# Altium project PCB_Project.PrjPcb
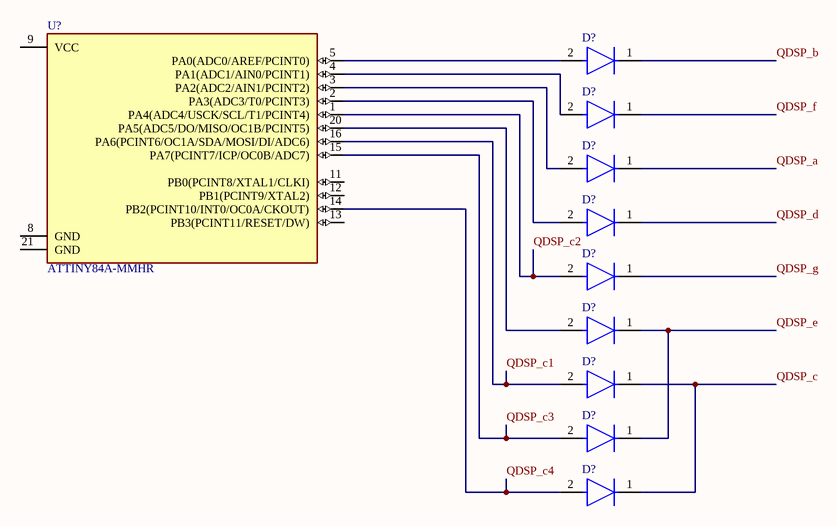
[diagram p0: main.SchDoc]
1 sheet, 10 parts. Net scope: global (net labels, ports and power ports of the same name join across sheets).

## Sheet main.SchDoc
size A4; SheetNumber: 1; SheetTotal: 1

### Parts
(Parts that share a designator on the sheet are numbered #1, #2 ... from top to bottom, then left to right.)
D?#1  1N4148  [FP-017AG-MFG]  (value not drawn)
D?#2  1N4148  [FP-017AG-MFG]  (value not drawn)
D?#3  1N4148  [FP-017AG-MFG]  (value not drawn)
D?#4  1N4148  [FP-017AG-MFG]  (value not drawn)
D?#5  1N4148  [FP-017AG-MFG]  (value not drawn)
D?#6  1N4148  [FP-017AG-MFG]  (value not drawn)
D?#7  1N4148  [FP-017AG-MFG]  (value not drawn)
D?#8  1N4148  [FP-017AG-MFG]  (value not drawn)
D?#9  1N4148  [FP-017AG-MFG]  (value not drawn)
U?  ATTINY84A-MMHR  [QFN45P300X300X85-21N]

### Nets
QDSP_a: D?#3.1(C)
QDSP_b: D?#1.1(C)
QDSP_c: D?#7.1(C) D?#9.1(C)
QDSP_c1: D?#7.2(A) U?.16(PA6(PCINT6/OC1A/SDA/MOSI/DI/ADC6))
QDSP_c2: D?#5.2(A) U?.1(PA4(ADC4/USCK/SCL/T1/PCINT4))
QDSP_c3: D?#8.2(A) U?.15(PA7(PCINT7/ICP/OC0B/ADC7))
QDSP_c4: D?#9.2(A) U?.14(PB2(PCINT10/INT0/OC0A/CKOUT))
QDSP_d: D?#4.1(C)
QDSP_e: D?#6.1(C) D?#8.1(C)
QDSP_f: D?#2.1(C)
QDSP_g: D?#5.1(C)
NetD?#1_2: D?#1.2(A) U?.5(PA0(ADC0/AREF/PCINT0))
NetD?#2_2: D?#2.2(A) U?.4(PA1(ADC1/AIN0/PCINT1))
NetD?#3_2: D?#3.2(A) U?.3(PA2(ADC2/AIN1/PCINT2))
NetD?#4_2: D?#4.2(A) U?.2(PA3(ADC3/T0/PCINT3))
NetD?#6_2: D?#6.2(A) U?.20(PA5(ADC5/DO/MISO/OC1B/PCINT5))

Not connected (* = marked no-connect by the designer): U? 8(GND) 9(VCC) 11(PB0(PCINT8/XTAL1/CLKI)) 12(PB1(PCINT9/XTAL2)) 13(PB3(PCINT11/RESET/DW)) 21(GND)

### Library data of the parts
D?#1-D?#9 = CMP-07163-000046-1: DIODE GEN PURP 100V 200MA DO35; Forward Voltage: 1V; Max Power Dissipation: 500mW; Max Reverse Current: 5uA; Forward Current: 300mA; Current: 4A; Reverse Recovery Time: 4ns; Element Configuration: Single; Outside Diameter: 1.85mm; Capacitance: 4pF; Polarity: Standard; Max Forward Surge Current (Ifsm): 1A; Reverse Voltage: 100V; Output Current: 200mA; Average Rectified Current: 200mA; Diameter: 1.91mm; Max Repetitive Reverse Voltage (Vrrm): 100V; Current Rating: 200mA; Case/Package: DO-35; Lead Free: Lead Free; Number of Pins: 2; Recovery Time: 4ns; Packaging: Bulk; Contact Plating: Tin; Voltage: 100V; Mount: Through Hole; Max Surge Current: 4A; Package Quantity: 2000; Width: 1.91mm; Max Reverse Voltage (DC): 100V; Length: 4.56mm; Radiation Hardening: No; Power Dissipation: 500mW; Voltage Rating (DC): 100V; Peak Non-Repetitive Surge Current: 4A; REACH SVHC: No SVHC; Height: 4.56mm; Max Operating Temperature: 175°C; Series: -; Weight: 0.01lb; Min Operating Temperature: -65°C
U? = ATTINY84A-MMHR: AVR series Microcontroller IC 8-Bit 20MHz 8KB (4K x 16) FLASH 20-VQFN (3x3); MF: Microchip Technology; Availability: In Stock; Price: None; Check_prices: https://www.snapeda.com/parts/ATTINY84A-MMHR/Microchip/view-part/?ref=eda; SnapEDA_Link: https://www.snapeda.com/parts/ATTINY84A-MMHR/Microchip/view-part/?ref=snap; Package: DFN-20 Microchip; Purchase-URL: https://pricing.snapeda.com/search/part/ATTINY84A-MMHR/?ref=eda; Value: *; MP: ATTINY84A-MMHR